# EAGLE design sensor_board_v1 (EAGLE 7.3.0)
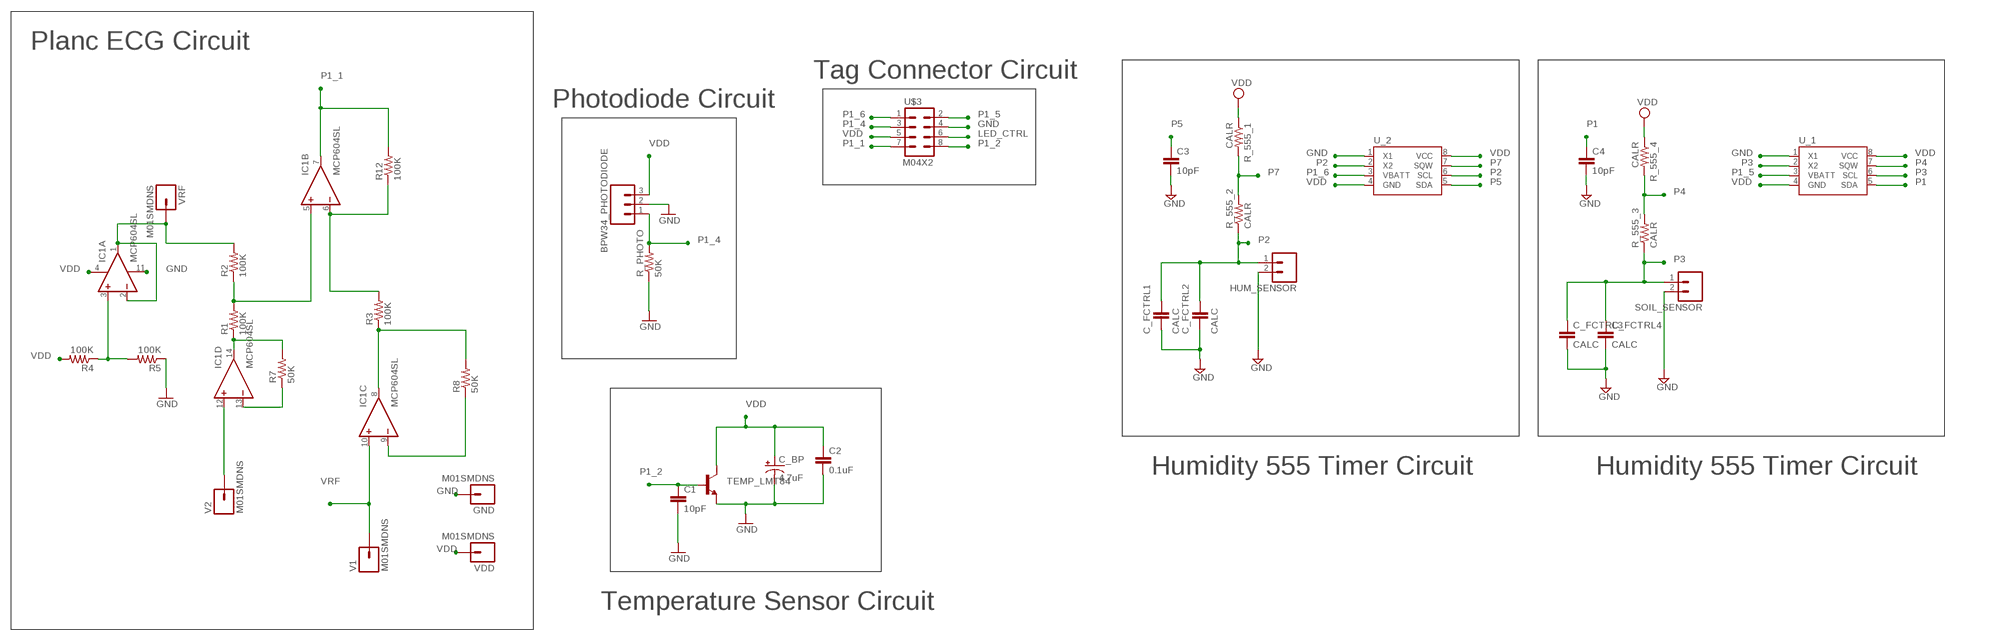
[diagram p0: schematic, sheet 1]

## Parts
BPW34_PHOTODIODE  PDI  M03PTH  [1X03]
C1  10pF  CAP0805  [0805]
C2  0.1uF  CAP0805  [0805]
C3  10pF  CAP0805  [0805]
C4  10pF  CAP0805  [0805]
C_BP  4.7uF  10UF-TANT  [EIA3216]
C_FCTRL1  CALC  CAP0805  [0805]
C_FCTRL2  CALC  CAP0805  [0805]
C_FCTRL3  CALC  CAP0805  [0805]
C_FCTRL4  CALC  CAP0805  [0805]
GND  M01SMDNS  [1X01NS]
HUM_SENSOR  M02LOCK  [1X02_LOCK]
IC1  MCP604SL  [SO14]
R1  100K  RESISTOR  [0805]
R2  100K  RESISTOR  [0805]
R3  100K  RESISTOR  [0805]
R4  100K  RESISTOR  [0805]
R5  100K  RESISTOR  [0805]
R7  50K  RESISTOR  [0805]
R8  50K  RESISTOR  [0805]
R12  100K  RESISTOR  [0805]
R_555_1  CALR  RESISTOR  [0805]
R_555_2  CALR  RESISTOR  [0805]
R_555_3  CALR  RESISTOR  [0805]
R_555_4  CALR  RESISTOR  [0805]
R_PHOTO  50K  RESISTOR  [0805]
SOIL_SENSOR  M02LOCK  [1X02_LOCK]
TEMP_LMT84  TRANSISTOR_NPNTO92  [TO-92]
U$3  M04X2  [2X4]
U_1  DS1307SO8  [SO08]
U_2  DS1307SO8  [SO08]
V1  M01SMDNS  [1X01NS]
V2  M01SMDNS  [1X01NS]
VDD  M01SMDNS  [1X01NS]
VRF  M01SMDNS  [1X01NS]

## Nets
GND: BPW34_PHOTODIODE.2 C1.2 C2.2 C3.2 C4.2 C_BP.C(-) C_FCTRL1.2 C_FCTRL2.2 C_FCTRL3.2 C_FCTRL4.2 GND.1 HUM_SENSOR.2 IC1.11(P:V-) R5.1 R_PHOTO.1 SOIL_SENSOR.2 TEMP_LMT84.1(E) U$3.4 U_1.1(X1) U_2.1(X1)
LED_CTRL: U$3.6
N$1: IC1.9(C:-IN) R8.1
N$2: IC1.3(A:+IN) R4.1 R5.2
N$3: IC1.13(D:-IN) R7.1
N$4: IC1.12(D:+IN) V2.1
N$7: IC1.5(B:+IN) R1.2 R2.1
N$93: IC1.8(C:OUT) R3.1 R8.2
N$96: IC1.14(D:OUT) R1.1 R7.2
N$100: IC1.6(B:-IN) R3.2 R12.1
P1: C4.1 U_1.5(SDA)
P1_1: IC1.7(B:OUT) R12.2 U$3.7
P1_2: C1.1 TEMP_LMT84.2(B) U$3.8
P1_4: BPW34_PHOTODIODE.1 R_PHOTO.2 U$3.3
P1_5: U$3.2 U_1.3(VBATT)
P1_6: U$3.1 U_2.3(VBATT)
P2: C_FCTRL1.1 C_FCTRL2.1 HUM_SENSOR.1 R_555_2.1 U_2.2(X2) U_2.6(SCL)
P3: C_FCTRL3.1 C_FCTRL4.1 R_555_3.1 SOIL_SENSOR.1 U_1.2(X2) U_1.6(SCL)
P4: R_555_3.2 R_555_4.2 U_1.7(SQW)
P5: C3.1 U_2.5(SDA)
P7: R_555_1.2 R_555_2.2 U_2.7(SQW)
VDD: BPW34_PHOTODIODE.3 C2.1 C_BP.A(+) IC1.4(P:V+) R4.2 R_555_1.1 R_555_4.1 TEMP_LMT84.3(C) U$3.5 U_1.4(GND) U_1.8(VCC) U_2.4(GND) U_2.8(VCC) VDD.1
VRF: IC1.1(A:OUT) IC1.2(A:-IN) IC1.10(C:+IN) R2.2 V1.1 VRF.1

## Notes on the sheet
- Planc ECG Circuit
- Tag Connector Circuit
- Photodiode Circuit
- Humidity 555 Timer Circuit | Humidity 555 Timer Circuit
- Temperature Sensor Circuit

## Library data of the parts
BPW34_PHOTODIODE = SparkFun-Connectors:M03: Header 3 Standard 3-pin 0.1" header. Use with straight break away headers (SKU : PRT-00116), right angle break away headers (PRT-00553), swiss pins (PRT-00743), machine pins (PRT-00117), and female headers (PRT-00115). Molex polarized connector foot print use with SKU : PRT-08232 with associated crimp pins and housings.
C1-C4 C_FCTRL1-C_FCTRL4 = SparkFun-Capacitors:CAP: Capacitor Standard 0603 ceramic capacitor, and 0.1" leaded capacitor.
C_BP = SparkFun-Capacitors:10UF-TANT: 10uF Tantalum SMT CAP-00811- 16V 10% (EIA-3216); PROD_ID: CAP-00811; VALUE: 10uF
GND V1 V2 VDD VRF = SparkFun-Connectors:M01: Header 1 Standard 1-pin 0.1" header. Use with straight break away headers (SKU : PRT-00116), right angle break away headers (PRT-00553), swiss pins (PRT-00743), machine pins (PRT-00117), and female headers (PRT-00115).
HUM_SENSOR SOIL_SENSOR = SparkFun-Connectors:M02: Header 2 Standard 2-pin 0.1" header. Use with straight break away headers (SKU : PRT-00116), right angle break away headers (PRT-00553), swiss pins (PRT-00743), machine pins (PRT-00117), and female headers (PRT-00115). Molex polarized connector foot print use with SKU : PRT-08233 with associated crimp pins and housings.
IC1 = linear:MCP604: Quad Op Amp 2.7V to 6.0V Single Supply CMOS Source: http://ww1.microchip.com/downloads/en/DeviceDoc/21314g.pdf
R1-R5 R7 R8 R12 R_555_1-R_555_4 R_PHOTO = SparkFun:RESISTOR: Resistor Basic schematic elements and footprints for 0603, 1206, and PTH 1/10th watt (small) resistors.
TEMP_LMT84 = SparkFun-DiscreteSemi:TRANSISTOR_NPN: Generic NPN BJT. MMBT2222 is the common NPN we use. Double check against datasheet- not all devices are the same!
U$3 = SparkFun-Connectors:M04X2: .1" header, two rows of four.
U_1 U_2 = SparkFun-FreqCtrl:DS1307: I2C real-time clock with battery backup.

## Board
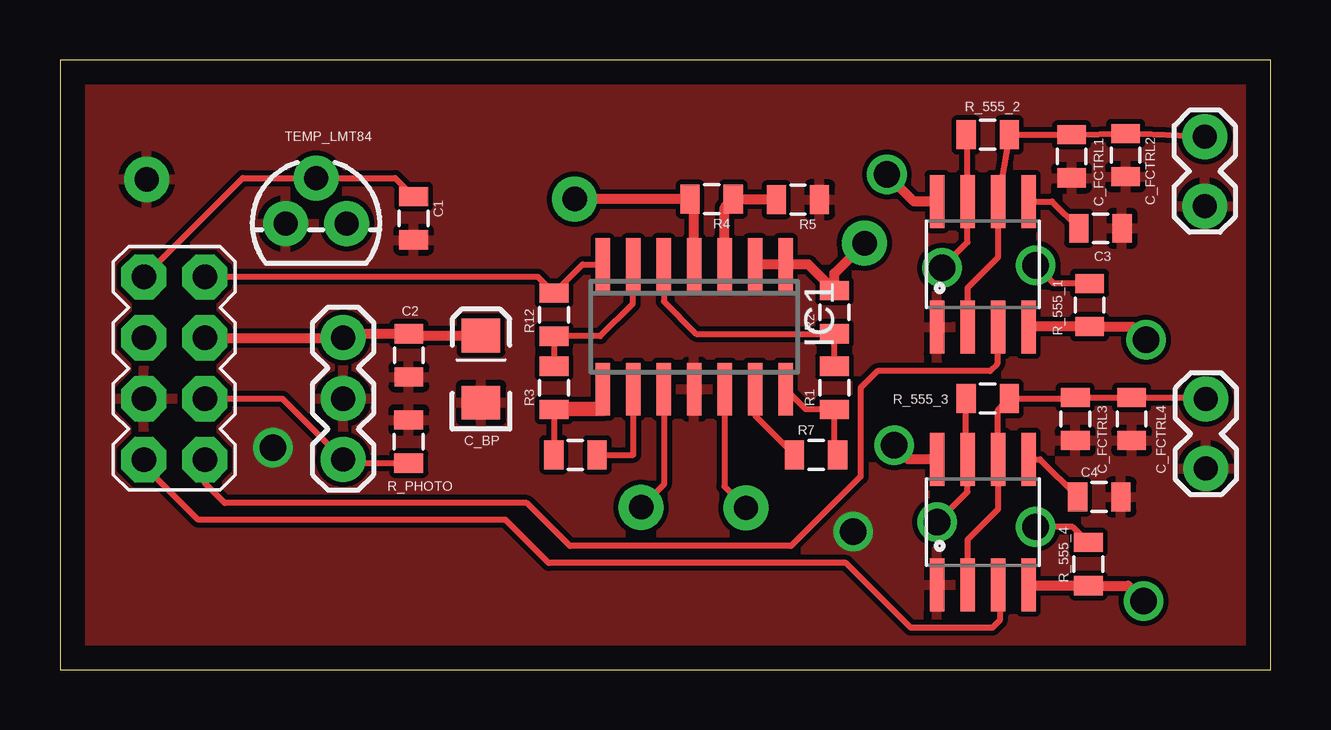
[diagram p1: board, top side]
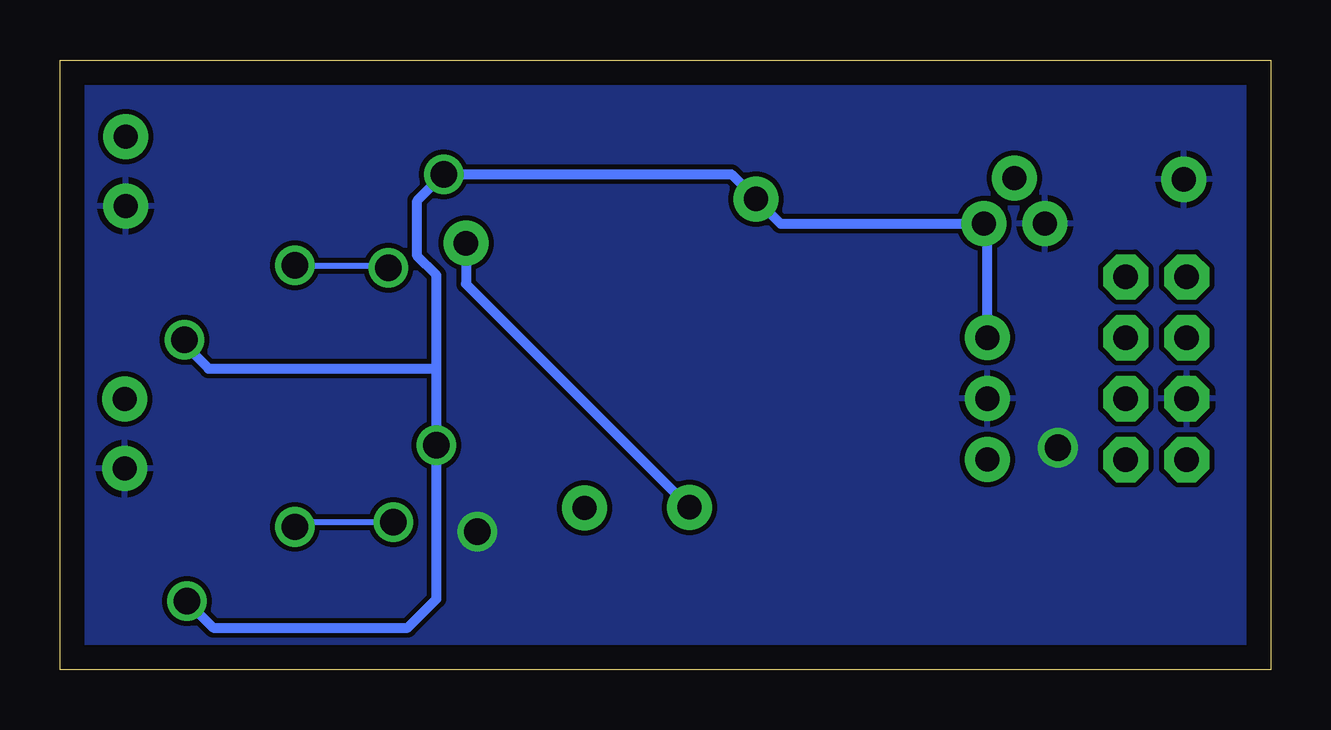
[diagram p2: board, bottom side, seen from below]

Size 50.46 x 25.43 mm. Coordinates in mm from the lower left corner, seen from the top.
Outline: 0,0 50.46,0 50.46,25.43 0,25.43 0,0
Copper layers (1*16): Top 0.035mm / dielectric 1.5mm / Bottom 0.035mm
Design rules "default": minimum track width 10mil, minimum drill 24mil, track to track 8mil, track to pad 8mil, pad to pad 8mil, via to via 8mil, smd to smd 8mil, copper to edge 40mil, drill to drill 8mil, minimum pad ring 10mil, minimum via ring 8mil, stop-mask expansion 4mil, vias tented up to drill 0mil, thermal gap 10mil

### Footprints (pad centres in the part's own frame; a part is rotated, then mirrored left to right if it is on the bottom)
1X03 = drill 1.016 pad 1.88: 1 0,0; 2 2.54,0; 3 5.08,0
0805 = smd 0.8 x 1.2: 1 -0.9,0; 2 0.9,0
EIA3216 = smd 1.4 x 1.6: A 1.4,0; C -1.4,0
1X01NS = drill 1.016 pad 1.88: 1 0,0
1X02_LOCK = drill 1 pad 1.88: 1 -0.178,0; 2 2.718,0
SO14 = smd 0.6 x 2.2: 1 -3.81,-2.6; 2 -2.54,-2.6; 3 -1.27,-2.6; 4 0,-2.6; 5 1.27,-2.6; 6 2.54,-2.6; 7 3.81,-2.6; 8 3.81,2.6; 9 2.54,2.6; 10 1.27,2.6; 11 0,2.6; 12 -1.27,2.6; 13 -2.54,2.6; 14 -3.81,2.6
TO-92 = drill 1 pad 1.88: 1 -1.27,0; 2 0,1.905; 3 1.27,0
2X4 = drill 1.016 pad 1.88 octagon: 1 -3.81,-1.27; 2 -3.81,1.27; 3 -1.27,-1.27; 4 -1.27,1.27; 5 1.27,-1.27; 6 1.27,1.27; 7 3.81,-1.27; 8 3.81,1.27
SO08 = smd 0.61 x 2.21: 1 -1.905,-2.616; 2 -0.635,-2.616; 3 0.635,-2.616; 4 1.905,-2.616; 5 1.905,2.616; 6 0.635,2.616; 7 -0.635,2.616; 8 -1.905,2.616

### Placement (x,y rotation side)
BPW34_PHOTODIODE  11.8,8.77 90 top
C1  14.74,18.82 270 top
C2  14.54,13.11 270 top
C3  43.37,18.41 0 top
C4  43.32,7.21 0 top
C_BP  17.55,12.54 90 top
C_FCTRL1  42.17,21.41 270 top
C_FCTRL2  44.42,21.46 270 top
C_FCTRL3  42.32,10.46 270 top
C_FCTRL4  44.67,10.46 270 top
GND  3.62,20.45 0 top
HUM_SENSOR  47.72,22.06 270 top
IC1  26.44,14.3 180 top
R1  32.28,11.76 90 top
R2  32.28,14.91 90 top
R3  20.59,11.76 90 top
R4  27.17,19.62 180 top
R5  30.76,19.6 180 top
R7  31.52,8.96 0 top
R8  21.48,8.96 180 top
R12  20.59,14.81 90 top
R_555_1  42.92,15.21 90 top
R_555_2  38.67,22.31 180 top
R_555_3  38.67,11.31 180 top
R_555_4  42.87,4.41 90 top
R_PHOTO  14.54,9.52 270 top
SOIL_SENSOR  47.77,11.11 270 top
TEMP_LMT84  10.68,18.6 0 top
U$3  4.77,12.57 90 top
U_1  38.47,6.16 0 top
U_2  38.47,16.91 0 top
V1  24.22,6.77 0 top
V2  28.59,6.75 0 top
VDD  21.45,19.63 0 top
VRF  33.54,17.79 0 top

### Tracks (layer width: path | path; a pad name or v marks a point on that pad's centre or on a via)
GND  (via drill 1.1)
  other vias: 8.87,9.26 33.07,5.76
  pour Top: -1.53,39.86 70.77,39.86 70.77,-2.34 -1.73,-2.34 -1.73,39.76
  pour Bottom: -2.43,28.56 61.97,28.56 61.97,-2.84 -2.53,-2.84 -2.53,28.56
N$1
  Top 0.254: R8.1 23.9,8.96 IC1.9
N$2
  Top 0.406: IC1.3 27.71,19.27 R4.1 29.84,19.62 R5.2
N$3
  Top 0.254: R7.1 28.98,10.6 IC1.13
N$4
  Top 0.254: IC1.12 27.69,11.68 27.69,7.65 V2.1
N$7
  Top 0.254: IC1.5 25.17,15.36 26.52,14.01 R2.1 R1.2
N$93
  Top 0.254: 20.71,10.86 R3.1 20.58,10.85 R8.2
  Top 0.61: IC1.8 22.63,10.87 R3.1
N$96
  Top 0.254: R7.2 32.28,9.1 R1.1 31.09,10.86 IC1.14
N$100
  Top 0.254: IC1.6 23.87,16.87 23.87,15.26 22.51,13.91 R12.1 R3.2
P1
  Top 0.254: U_1.5 40.85,8.77 C4.1
P1_1
  Top 0.254: IC1.7 21.79,16.9 R12.2 19.92,16.38 U$3.7
P1_2
  Top 0.254: U$3.8 7.62,20.51 TEMP_LMT84.2 13.96,20.51 C1.1
P1_4
  Top 0.254: U$3.3 9.27,11.3 BPW34_PHOTODIODE.1 11.95,8.62 R_PHOTO.2
P1_5
  Top 0.254: U_1.3 39.17,3.48 39.17,2.06 38.87,1.76 35.47,1.76 32.77,4.46 20.37,4.46 18.57,6.26 5.77,6.26 3.5,8.53 U$3.2
P1_6
  Top 0.254: U_2.3 39.07,14.26 39.07,12.76 38.77,12.46 34.07,12.46 33.37,11.76 33.37,8.06 30.47,5.16 21.27,5.16 19.47,6.96 6.87,6.96 6.03,7.79 U$3.1
P2
  Top 0.254: HUM_SENSOR.1 C_FCTRL2.1 C_FCTRL1.1 R_555_2.1 U_2.6 39.1,17.19 37.83,15.92 U_2.2
P3
  Top 0.254: U_1.2 37.83,5.42 39.1,6.69 U_1.6 39.1,10.84 R_555_3.1 42.27,11.31 C_FCTRL3.1 C_FCTRL4.1 47.7,11.36 SOIL_SENSOR.1
P4  (via drill 1.1)
  Top 0.254: R_555_4.2 42.22,5.96 v40.67,5.96 | v36.57,6.16 37.83,7.42 U_1.7 37.77,8.84 R_555_3.2
  Bottom 0.254: v40.67,5.96 40.47,6.16 v36.57,6.16
P5
  Top 0.254: U_2.5 41.35,19.52 C3.1
P7  (via drill 1.1)
  Top 0.254: R_555_2.2 37.83,22.24 U_2.7 37.83,17.82 v36.77,16.76 | R_555_1.2 41.42,16.11 v40.67,16.86
  Bottom 0.254: v40.67,16.86 36.87,16.86 v36.77,16.76
VDD  (via drill 1.1)
  Top 0.406: IC1.4 26.44,19.45 R4.2 VDD.1 | U$3.5 BPW34_PHOTODIODE.3 11.97,14.01 C2.1 14.62,13.94 C_BP.A | U_2.8 35.6,19.52 v34.47,20.66 | U_1.8 35.35,8.77 v34.77,9.36 | v45.27,13.76 44.72,14.31 R_555_1.1 40.39,14.31 U_2.4 | v45.17,2.86 44.52,3.51 R_555_4.1 40.41,3.51 U_1.4
  Bottom 0.406: BPW34_PHOTODIODE.3 11.8,18.46 TEMP_LMT84.3 20.42,18.6 VDD.1 22.48,20.66 v34.47,20.66 35.57,19.56 35.57,17.26 34.77,16.46 34.77,12.66 | 34.77,12.66 v34.77,9.36 34.77,2.96 35.97,1.76 44.07,1.76 v45.17,2.86 | v45.27,13.76 45.27,13.56 44.27,12.56 34.87,12.56 34.77,12.66
VRF
  Top 0.254: IC1.10 25.17,7.72 V1.1
  Top 0.406: IC1.2 IC1.1 31.19,16.9 R2.2 32.28,16.53 VRF.1
  Bottom 0.406: VRF.1 33.54,16.09 V1.1